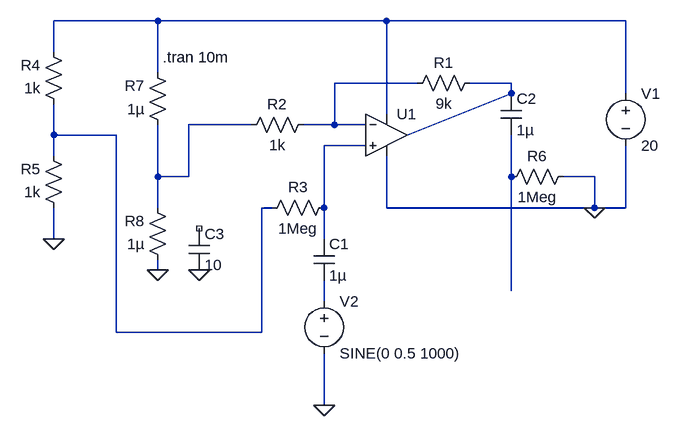
[diagram p0: schematic Amp_with_Vcc.asc]
Amp_with_Vcc.asc, the LTspice schematic file:
Version 4
SHEET 1 956 680
WIRE 176 48 16 48
WIRE 528 48 176 48
WIRE 896 48 528 48
WIRE 16 96 16 48
WIRE 176 128 176 48
WIRE 576 144 448 144
WIRE 720 144 656 144
WIRE 720 160 720 144
WIRE 896 160 896 48
WIRE 528 192 528 48
WIRE 320 208 224 208
WIRE 448 208 448 144
WIRE 448 208 400 208
WIRE 496 208 448 208
WIRE 16 224 16 176
WIRE 112 224 16 224
WIRE 560 224 720 160
WIRE 496 240 432 240
WIRE 16 256 16 224
WIRE 176 288 176 208
WIRE 224 288 224 208
WIRE 224 288 176 288
WIRE 720 288 720 224
WIRE 848 288 800 288
WIRE 176 336 176 288
WIRE 352 336 336 336
WIRE 432 336 432 240
WIRE 528 336 528 256
WIRE 848 336 848 288
WIRE 848 336 528 336
WIRE 896 336 896 240
WIRE 896 336 848 336
WIRE 16 384 16 336
WIRE 432 384 432 336
WIRE 176 432 176 416
WIRE 720 464 720 288
WIRE 432 480 432 448
WIRE 112 528 112 224
WIRE 336 528 336 336
WIRE 336 528 112 528
WIRE 432 640 432 560
FLAG 848 336 0
FLAG 432 640 0
FLAG 16 384 0
FLAG 240 432 0
FLAG 176 432 0
SYMBOL UniversalOpamp2 528 224 R0
SYMATTR InstName U1
SYMBOL voltage 896 144 R0
SYMATTR InstName V1
SYMATTR Value 20
SYMBOL res 672 128 R90
WINDOW 0 0 56 VBottom 2
WINDOW 3 32 56 VTop 2
SYMATTR InstName R1
SYMATTR Value 9k
SYMBOL res 416 192 R90
WINDOW 0 0 56 VBottom 2
WINDOW 3 32 56 VTop 2
SYMATTR InstName R2
SYMATTR Value 1k
SYMBOL voltage 432 464 R0
SYMATTR InstName V2
SYMATTR Value SINE(0 0.5 1000)
SYMBOL res 448 320 R90
WINDOW 0 0 56 VBottom 2
WINDOW 3 32 56 VTop 2
SYMATTR InstName R3
SYMATTR Value 1Meg
SYMBOL cap 416 384 R0
SYMATTR InstName C1
SYMATTR Value 1µ
SYMBOL res 32 192 R180
WINDOW 0 36 76 Left 2
WINDOW 3 36 40 Left 2
SYMATTR InstName R4
SYMATTR Value 1k
SYMBOL res 32 352 R180
WINDOW 0 36 76 Left 2
WINDOW 3 36 40 Left 2
SYMATTR InstName R5
SYMATTR Value 1k
SYMBOL cap 704 160 R0
SYMATTR InstName C2
SYMATTR Value 1µ
SYMBOL res 816 272 R90
WINDOW 0 0 56 VBottom 2
WINDOW 3 32 56 VTop 2
SYMATTR InstName R6
SYMATTR Value 1Meg
SYMBOL cap 224 368 R0
SYMATTR InstName C3
SYMATTR Value 10
SYMBOL res 192 224 R180
WINDOW 0 36 76 Left 2
WINDOW 3 36 40 Left 2
SYMATTR InstName R7
SYMATTR Value 1µ
SYMBOL res 192 432 R180
WINDOW 0 36 76 Left 2
WINDOW 3 36 40 Left 2
SYMATTR InstName R8
SYMATTR Value 1µ
TEXT 184 104 Left 2 !.tran 10m

The netlist it stands for:
* Amp_with_Vcc.asc
XU1 N006 N002 N001 0 N003 level.2 Avol=1Meg GBW=10Meg Slew=10Meg ilimit=25m rail=0 Vos=0 phimargin=45 en=0 enk=0 in=0 ink=0 Rin=500Meg  ; pins IN+ IN- V+ V- OUT
V1 N001 0 20
R1 N003 N002 9k
R2 N002 N004 1k
V2 N008 0 SINE(0 0.5 1000)
R3 N006 N005 1Meg
C1 N006 N008 1µ
R4 N005 N001 1k
R5 0 N005 1k
C2 N003 N007 1µ
R6 0 N007 1Meg
C3 NC_01 0 10
R7 N004 N001 1µ
R8 0 N004 1µ
.tran 10m
.lib UniversalOpamps2.sub
.backanno
.end